# Altium schematic sheet Cover.SchDoc: Wireless Security Detector
size A4; SheetNumber: 1; SheetTotal: 5
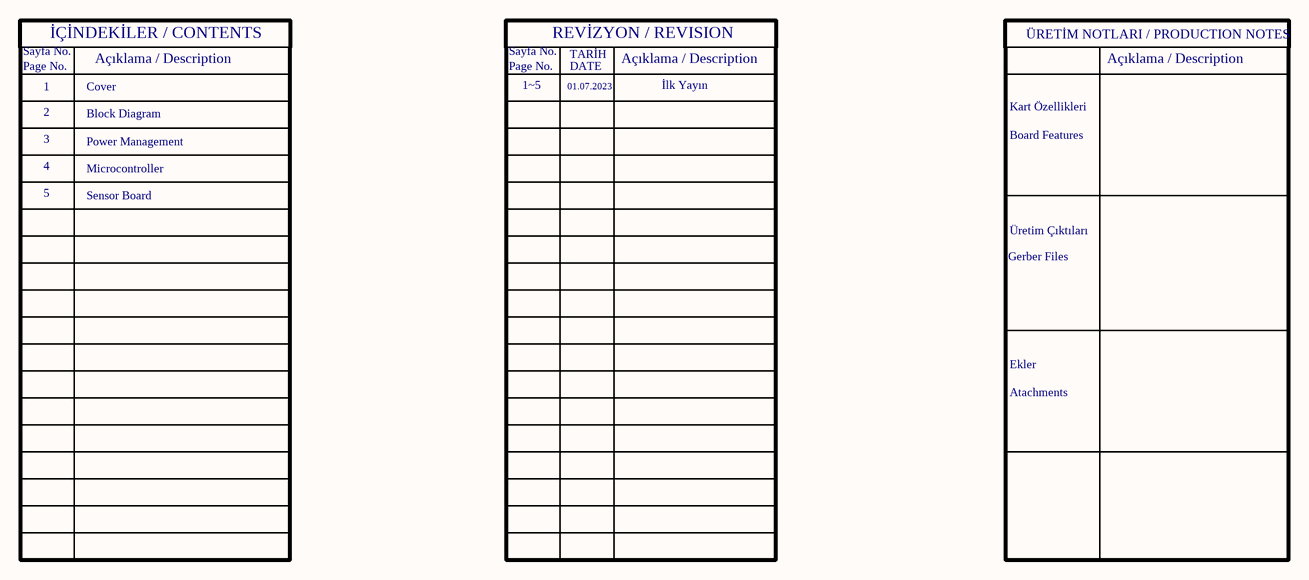
[diagram p0: Cover.SchDoc]

## Notes on the sheet
- Sayfa No.
- Page No.
- İÇİNDEKİLER / CONTENTS
- Açıklama / Description
- REVİZYON / REVISION
- TARİH
- DATE
- ÜRETİM NOTLARI / PRODUCTION NOTES
- 1
- 2
- 3
- Cover
- Block Diagram
- 1~5
- 01.07.2023
- İlk Yayın
- Kart Özellikleri
- Board Features
- 4
- 5
- Power Management
- Microcontroller
- Sensor Board
- Gerber Files
- Üretim Çıktıları
- Ekler
- Atachments